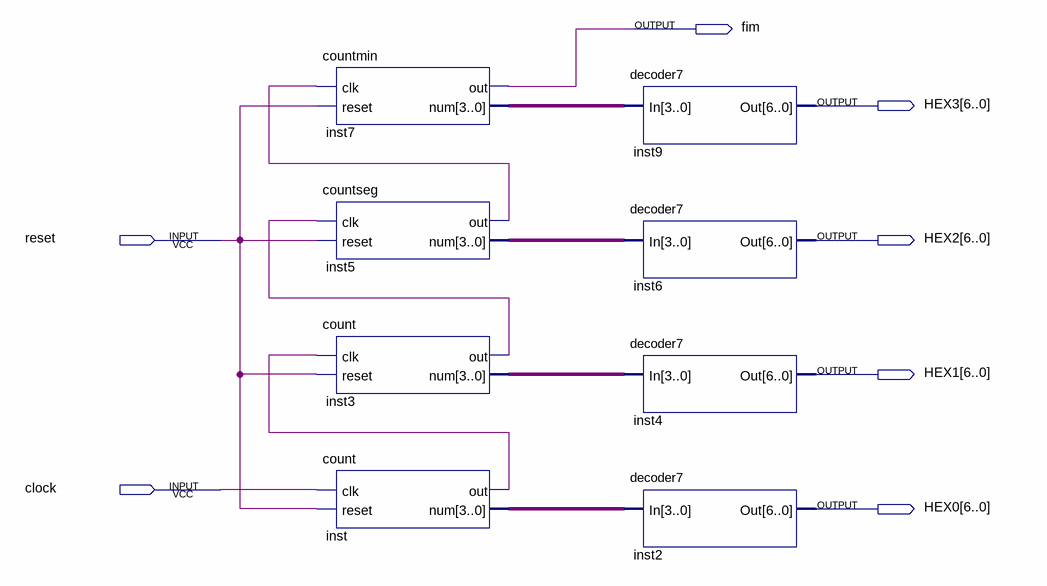
[diagram p0: schematic sheet]
// Quartus schematic cronometro.bdf as structural Verilog: 8 symbols, 7 pins
module cronometro (
  input  reset,
  input  clock,
  output fim,
  output [6:0] HEX3,
  output [6:0] HEX2,
  output [6:0] HEX1,
  output [6:0] HEX0
);

  wire inst3_out, inst5_out, inst_out;
  wire [3:0] inst3_num, inst5_num, inst7_num, inst_num;

  countmin inst7 (.clk(inst5_out), .reset(reset), .out(fim), .num(inst7_num));
  countseg inst5 (.clk(inst3_out), .reset(reset), .out(inst5_out), .num(inst5_num));
  count inst3 (.clk(inst_out), .reset(reset), .out(inst3_out), .num(inst3_num));
  count inst (.clk(clock), .reset(reset), .out(inst_out), .num(inst_num));
  decoder7 inst9 (.In(inst7_num), .Out(HEX3));
  decoder7 inst6 (.In(inst5_num), .Out(HEX2));
  decoder7 inst4 (.In(inst3_num), .Out(HEX1));
  decoder7 inst2 (.In(inst_num), .Out(HEX0));
endmodule
